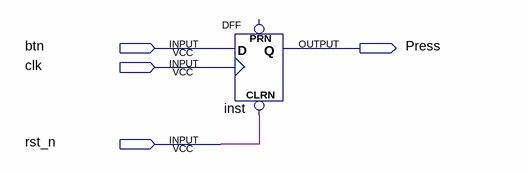
[diagram p0: schematic sheet]
// Quartus schematic press_detection.bdf as structural Verilog: 1 symbols, 4 pins
module press_detection (
  input  btn,
  input  clk,
  input  rst_n,
  output Press
);

  DFF inst (.CLRN(rst_n), .CLK(clk), .D(btn), .Q(Press));  // open: PRN
endmodule
